# Altium schematic sheet DAC_Buffer_Filter.SchDoc: DAC Buffer
size A4; DrawnBy: Michael Watzek; Organization: HTL Hollabrunn; Address1: Abteilung Elektronik; Address2: Anton Ehrenfried-Straße 10; Address3: 2020 Hollabrunn; DocumentNumber: 09; Revision: 01; SheetNumber: 09; SheetTotal: 12; SPICEModelCacheDRLOHMHD: <root> / <DocumentId>DRLOHMHD</DocumentId> / <CacheFrame Number="0"> / <Model Name="cap" Kind="MDL"> / <Text>*Default semiconductor capacitor / .MODEL CAP C()</Text> / </Model> / </CacheFrame> / </root>
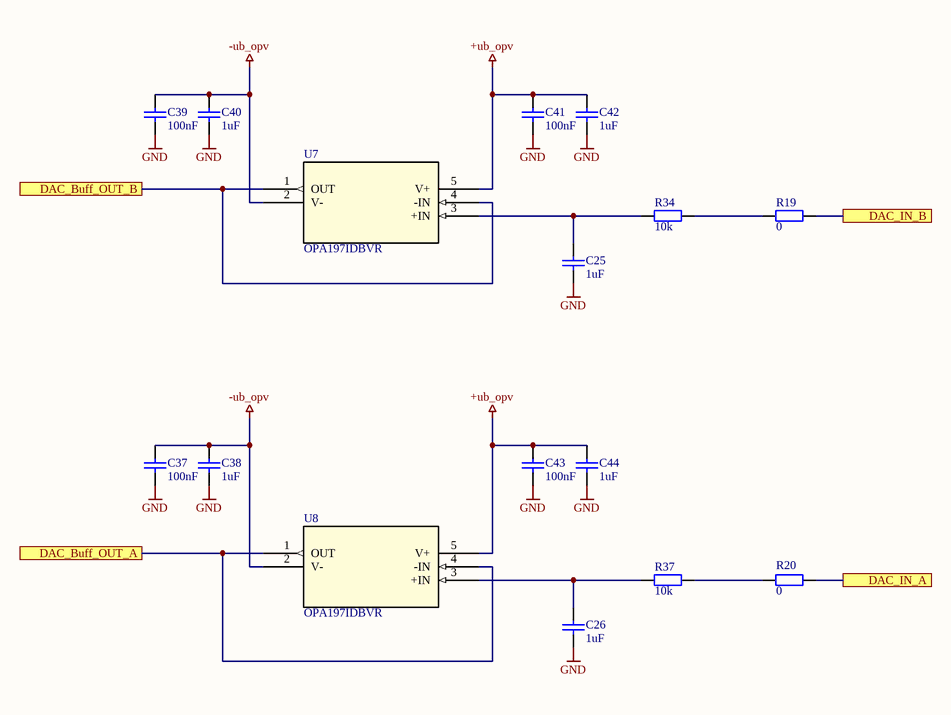
[diagram p0: DAC_Buffer_Filter.SchDoc]

## Parts
C25  1uF  [C1206-KUE]
C26  1uF  [C1206-KUE]
C37  100nF  [C1206-KUE]
C38  1uF  [C1206-KUE]
C39  100nF  [C1206-KUE]
C40  1uF  [C1206-KUE]
C41  100nF  [C1206-KUE]
C42  1uF  [C1206-KUE]
C43  100nF  [C1206-KUE]
C44  1uF  [C1206-KUE]
R19  0  [C1206-KUE]
R20  0  [C1206-KUE]
R34  10k  [C1206-KUE]
R37  10k  [C1206-KUE]
U7  OPA197IDBVR  [DBV5_TEX]
U8  OPA197IDBVR  [DBV5_TEX]

## Ports
DAC_Buff_OUT_A, DAC_Buff_OUT_B, DAC_IN_A, DAC_IN_B

## Nets
+ub_opv: C41.2 C42.2 C43.2 C44.2 U7.5(V+) U8.5(V+)
-ub_opv: C37.2 C38.2 C39.2 C40.2 U7.2(V-) U8.2(V-)
GND: C25.1 C26.1 C37.1 C38.1 C39.1 C40.1 C41.1 C42.1 C43.1 C44.1
DAC_Buff_OUT_A: U8.1(OUT) U8.4(-IN) ; port DAC_Buff_OUT_A
DAC_Buff_OUT_B: U7.1(OUT) U7.4(-IN) ; port DAC_Buff_OUT_B
DAC_IN_A: R20.1 ; port DAC_IN_A
DAC_IN_B: R19.1 ; port DAC_IN_B
NetC25_2: C25.2 R34.2 U7.3(+IN)
NetC26_2: C26.2 R37.2 U8.3(+IN)
NetR19_2: R19.2 R34.1
NetR20_2: R20.2 R37.1

## Notes on the sheet
- Title
- Size:
- Date:
- A4
- Number:
- Time:
- Revision:
- Sheet
- of
- HTL Hollabrunn
- Abteilung Elektronik
- Anton Ehrenfried-Straße 10
- 2020 Hollabrunn
- File:
- Drawn By:

## Library data of the parts
C25 C26 C37-C44 = Capacitor: Manufacturer: Kemet; Bezeichnung: Kerko +-10% 63V; Published: 8-Jun-2000; LatestRevisionDate: 17-Jul-2002; LatestRevisionNote: Re-released for DXP Platform.; PackageReference: RAD-0.3; Publisher: Altium Limited; PackageDescription: Radial Cap, Thru-Hole; 2 Leads; 0.3 in Pin Spacing; Orderingcode: *
  C25 C26 C38 C40 C42 C44: Value: 1uF
  C37 C39 C41 C43: Value: 100nF
R19 R20 R34 R37 = ResistorSMD: Resistor SMD; Manufacturer: AVX; Bezeichnung: SMD Wid. 1/8W 2%; Published: 8-Jun-2000; LatestRevisionDate: 17-Jul-2002; LatestRevisionNote: Re-released for DXP Platform.; PackageReference: AXIAL-0.4; Publisher: Altium Limited; PackageDescription: Axial Device, Thru-Hole; 2 Leads; 0.4 in Pin Spacing; Orderingcode: *
  R19 R20: Value: 0
  R34 R37: Value: 10k
U7 U8 = OPA197IDBVR: Single, 36-V, precision, rail-to-rail input output, low offset voltage op amp 5-SOT-23 -40 to 125; Manufacturer_Name: Texas Instruments; Copyright: Copyright (C) 2025 Ultra Librarian. All rights reserved.; Manufacturer_Part_Number: OPA197IDBVR; RefDes: RefDes; Type: Type